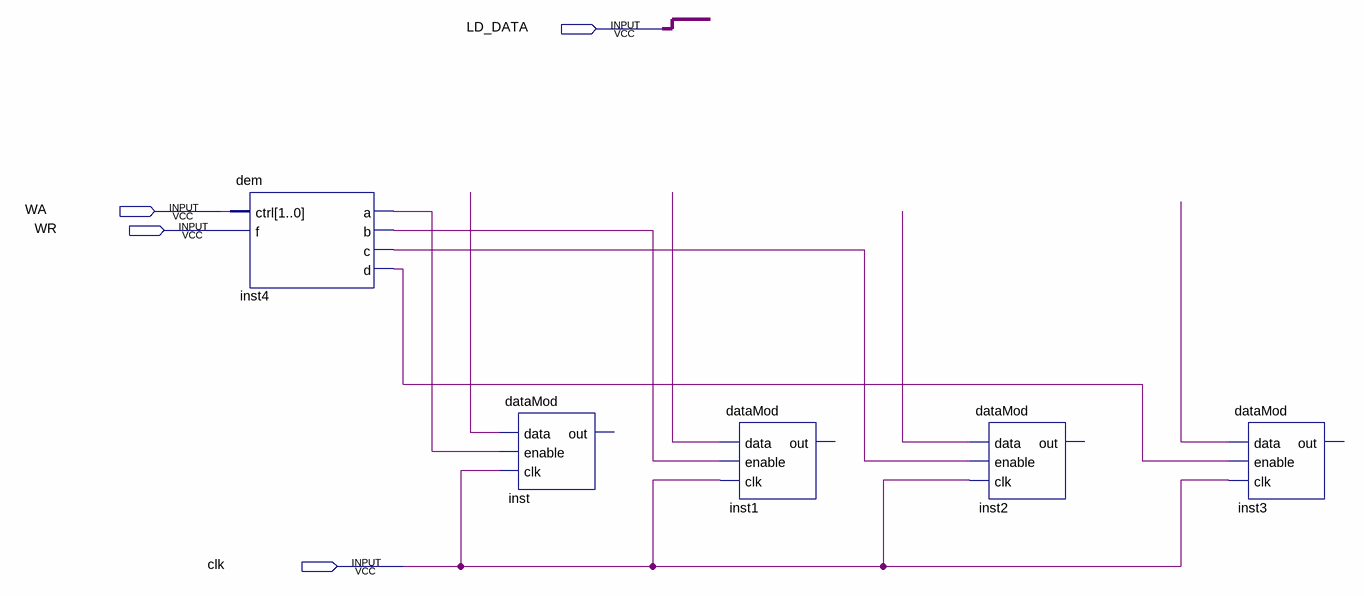
[diagram p0: schematic sheet]
// Quartus schematic ran.bdf as structural Verilog: 5 symbols, 4 pins
module ran (
  input  LD_DATA,
  input  WA,
  input  WR,
  input  clk
);

  wire inst4_a, inst4_b, inst4_c, inst4_d, undriven, undriven_2, undriven_3, undriven_4;

  dem inst4 (.ctrl({2{WA}}), .f(WR), .a(inst4_a), .b(inst4_b), .c(inst4_c), .d(inst4_d));
  dataMod inst (.data(undriven), .enable(inst4_a), .clk(clk));  // open: out
  dataMod inst1 (.data(undriven_2), .enable(inst4_b), .clk(clk));  // open: out
  dataMod inst2 (.data(undriven_3), .enable(inst4_c), .clk(clk));  // open: out
  dataMod inst3 (.data(undriven_4), .enable(inst4_d), .clk(clk));  // open: out
endmodule
